# EAGLE board HA_FONA_LARA_20 (EAGLE 9.6.1)
REV: B
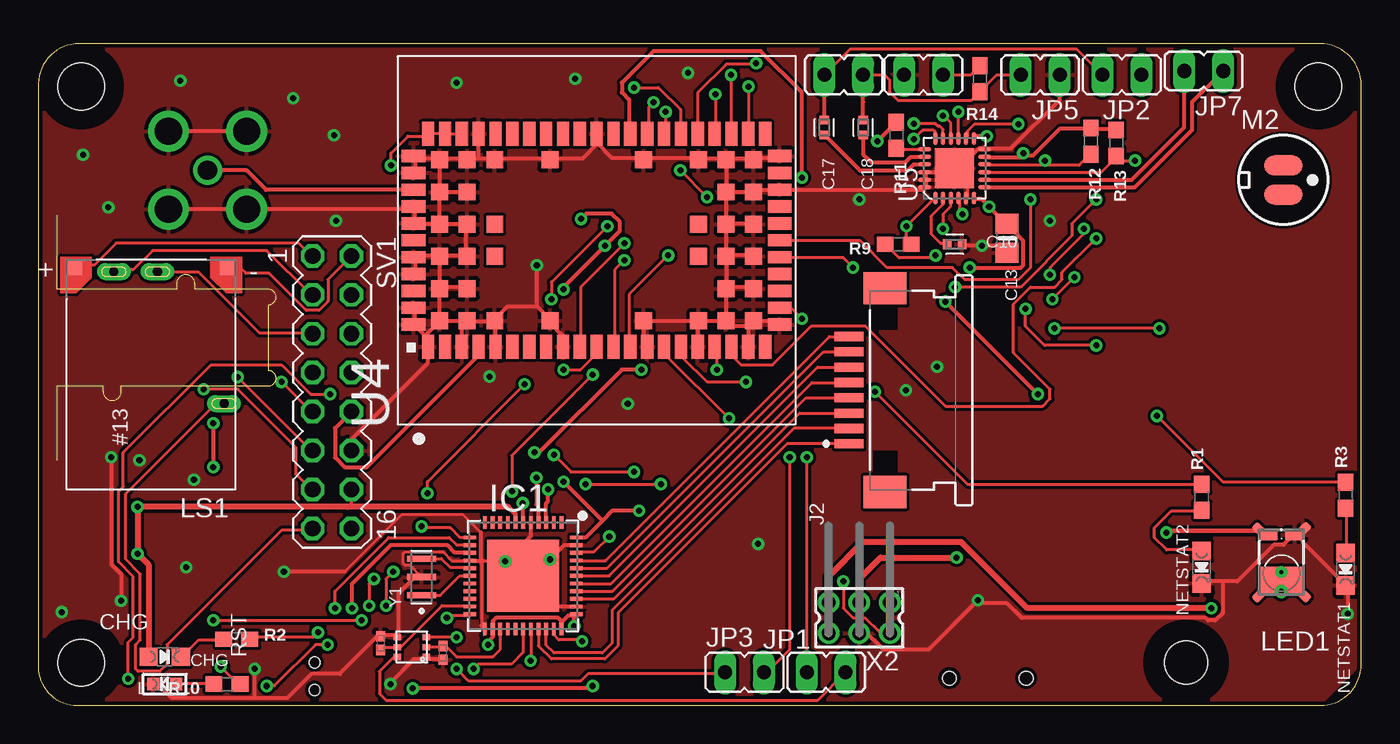
[diagram p2: board, top side]
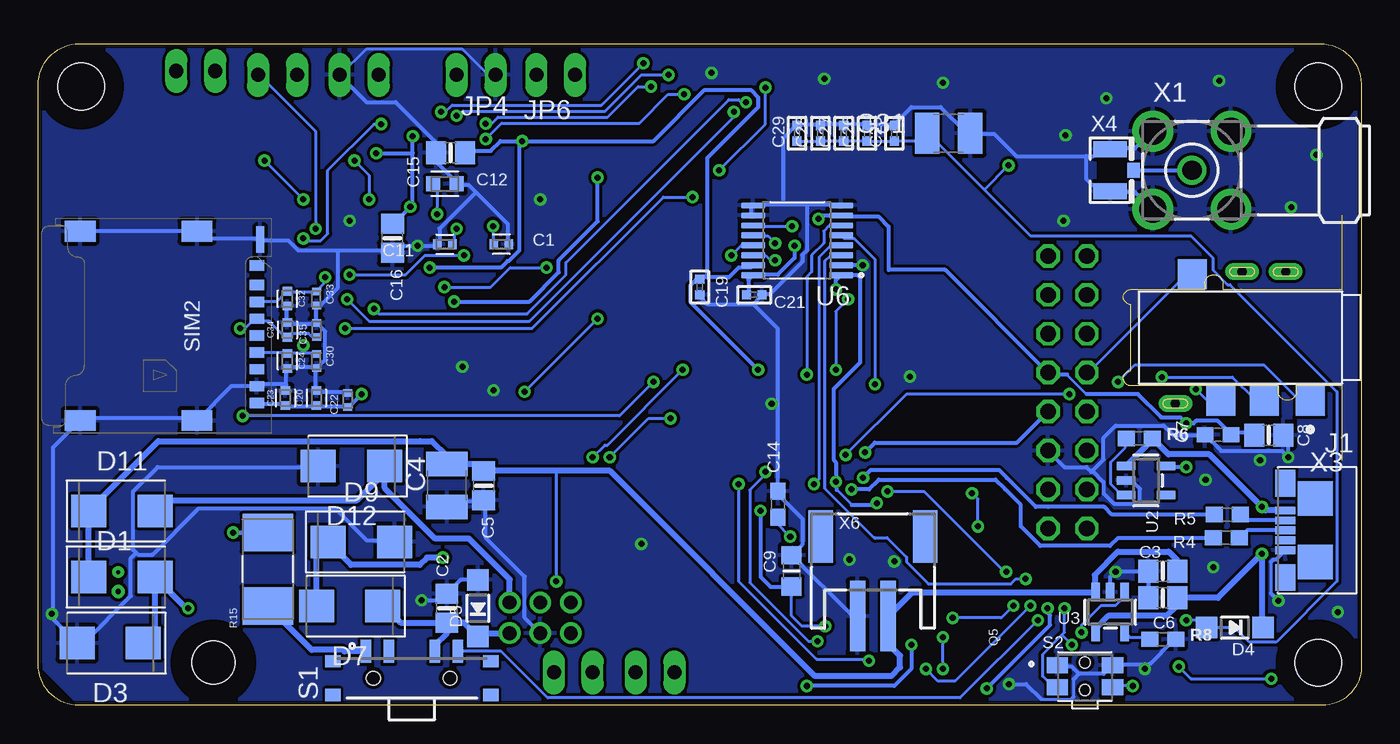
[diagram p3: board, bottom side, seen from below]

Size 86.36 x 43.18 mm. Coordinates in mm from the lower left corner, seen from the top.
Outline: 2.54,0 83.69,0 arc90 86.36,2.67 86.36,40.51 arc90 83.69,43.18 2.67,43.18 arc89 0,40.57 0,13.97 0,2.54 arc90 2.54,0
Copper layers (1*16): Top 0.035mm / dielectric 1.5mm / Bottom 0.035mm
Design rules "adafruit 6-6 *": minimum track width 6mil, minimum drill 15.5mil, track to track 8mil, track to pad 6mil, pad to pad 8mil, via to via 8mil, smd to smd 8mil, copper to edge 10mil, drill to drill 8mil, minimum pad ring 10mil, minimum via ring 8mil, stop-mask expansion 2mil, vias tented up to drill 20mil, thermal gap 10mil
Net classes: 0 default: width 0.19 mm, drill 0.19 mm
Holes 3.05 mm at 2.79,2.79 2.79,40.39 83.57,40.39
Holes 2.79 mm at 74.93,2.79
tKeepout: area 0,31 to 23.5,39.5
bKeepout: area 0,30.9 to 23.4,39.5
tRestrict: area 80.8,37.6 to 86.4,43.2; area 0,0 to 5.6,5.6; area 72.1,0 to 77.7,5.6; area 0,37.6 to 5.6,43.2
bRestrict: area 0,0 to 5.6,5.6; area 80.8,37.6 to 86.4,43.2; area 72.1,0 to 77.7,5.6; area 0,37.6 to 5.6,43.2
vRestrict: area 0,0 to 5.6,5.6; area 0,37.6 to 5.6,43.2; area 80.8,37.6 to 86.4,43.2; area 72.1,0 to 77.7,5.6

## Footprints (pad centres in the part's own frame; a part is rotated, then mirrored left to right if it is on the bottom)
CAPC1005X60 = smd 0.56 x 0.629: 1 -0.485,0; 2 0.485,0
0805-NO = smd 1.3 x 1.5: 1 -0.95,0; 2 0.95,0
C1210 = smd 1.6 x 2.7: 1 -1.4,0; 2 1.4,0
0603-NO = smd 1.1 x 1: 1 -0.85,0; 2 0.85,0
_0805MP = smd 1.2 x 1.3: 1 -1.016,0; 2 1.016,0
CAPC1608X85 = smd 0.921 x 0.97: 1 -0.775,0; 2 0.775,0
_0402 = smd 0.6 x 0.6: 1 -0.508,0; 2 0.508,0
RESC1005X35N = smd 0.49 x 0.6: 1 -0.457,0; 2 0.457,0
CHIPLED_0805_NOOUTLINE = smd 1.2 x 1.2: A 0,-1.05; C 0,1.05
DIOM5336X265N = smd 2.284 x 2.124: 1 -2.164,0; 2 2.164,0
SOD-123 = smd 1.4 x 1.4: A 1.85,0; C -1.85,0
TQFN44_7MM = smd 0.25 x 0.8: 1 -2.5,-3.475; 2 -2,-3.475; 3 -1.5,-3.475; 4 -1,-3.475; 5 -0.5,-3.475; 6 0,-3.475; 7 0.5,-3.475; 8 1,-3.475; 9 1.5,-3.475; 10 2,-3.475; 11 2.5,-3.475; 23 2.5,3.475; 24 2,3.475; 25 1.5,3.475; 26 1,3.475; 27 0.5,3.475; 28 0,3.475; 29 -0.5,3.475; 30 -1,3.475; 31 -1.5,3.475; 32 -2,3.475; 33 -2.5,3.475 | smd 0.8 x 0.25: 12 3.475,-2.5; 13 3.475,-2; 14 3.475,-1.5; 15 3.475,-1; 16 3.475,-0.5; 17 3.475,0; 18 3.475,0.5; 19 3.475,1; 20 3.475,1.5; 21 3.475,2; 22 3.475,2.5; 34 -3.475,2.5; 35 -3.475,2; 36 -3.475,1.5; 37 -3.475,1; 38 -3.475,0.5; 39 -3.475,0; 40 -3.475,-0.5; 41 -3.475,-1; 42 -3.475,-1.5; 43 -3.475,-2; 44 -3.475,-2.5 | smd 4.7 x 4.7: THERMAL 0,0
CUI_SJ2-35984E-SMT-TR = smd 1.9 x 1.95: 1 -4.55,4.125; 2 3.15,-4.125; 3 1.3,4.125; 4 -1.55,4.125 | drill 0.6 long: 10 4.25,4.3; 11 -0.1,-4.3; 12 -2.95,-4.3
MOLEX_52271-0879_0 = smd 0.6 x 1.9: 1 -3.5,1.175; 2 -2.5,1.175; 3 -1.5,1.175; 4 -0.5,1.175; 5 0.5,1.175; 6 1.5,1.175; 7 2.5,1.175; 8 3.5,1.175 | smd 2.1 x 2.8: MP1 -6.65,-1.175; MP2 6.65,-1.175
JP1 = drill 0.914 long: 1 0,-1.27; 2 0,1.27
MICROBUILDER_CHIPLED_0603 = smd 0.8 x 0.8: A 0,-0.75; C 0,0.75
LUXEON_REBEL = smd 1.26 x 0.73: A 0.87,-2.51; C -0.87,-2.51 | smd 1.1 x 0.57 rotated 315: A@1 1.39,-2.78 | smd 1.1 x 0.57 rotated 225: C@1 -1.39,-2.79 | smd 2.86 x 1.83: TH 0.01,0.49 | smd 1.1 x 0.57 rotated 135: TH@1 -1.39,1.37 | smd 1.1 x 0.57 rotated 45: TH@2 1.39,1.38 | drill 0.25 pad 0.35: TH@3 0.01,-0.06 | drill 0.35 pad 0.5: TH@4 0.01,1.2
SPKR_CMS-151135-078S-67 = smd 1 x 1: M -5,-6.99; P 5,-6.99
WM-61A = smd 2.5 x 1.3: 1 0,0.95; 2 0,-0.95
PWR_SC70-6L2 = smd 0.4 x 0.5: 1 -0.65,-0.95; 2 0,-0.95; 3 0.65,-0.95; 4 0.65,0.95; 5 0,0.95; 6 -0.65,0.95
0402-1005X55N = smd 0.62 x 0.62: 1 -0.45,0; 2 0.45,0
RESC6331X80N = smd 2.44 x 3.32: 1 -2.39,0; 2 2.39,0
SW_PCM13SMTR = smd 0.7 x 1.5: 1 -3,1.75; 2 -1.5,1.75; 3 1.5,1.75; 4 3,1.75 | smd 1 x 0.8: P$1 -5.15,1.1; P$2 -5.15,-1.1; P$3 5.15,1.1; P$4 5.15,-1.1 | hole 0.9: -2.5,0; 2.5,0
SW_EVQ-P7L01P = smd 1.4 x 1.05: 1_1 -1.8,0.725; 1_2 1.8,0.725; 2_1 -1.8,-0.725; 2_2 1.8,-0.725 | hole 0.7: 0,0.9; 0,-0.9
MICROSIM8 = smd 0.67 x 0.95: CLK -0.47,6.77; GND 3.93,6.77; IO -1.57,6.77; NC1 -2.67,6.77; NC2 -3.94,6.77; RST 1.73,6.77; SW 2.83,6.77; VCC 5.03,6.77; VPP 0.63,6.77 | smd 1.7 x 0.5: SH1 -5.64,6.995 | smd 1.35 x 2: SH2 -6.175,2.865; SH3 6.175,2.865; SH4 -6.175,-4.755; SH5 6.175,-4.755
MA08-2 = drill 1.016 octagon: 1 -8.89,-1.27; 2 -8.89,1.27; 3 -6.35,-1.27; 4 -6.35,1.27; 5 -3.81,-1.27; 6 -3.81,1.27; 7 -1.27,-1.27; 8 -1.27,1.27; 9 1.27,-1.27; 10 1.27,1.27; 11 3.81,-1.27; 12 3.81,1.27; 13 6.35,-1.27; 14 6.35,1.27; 15 8.89,-1.27; 16 8.89,1.27
SOT23-5 = smd 0.55 x 1.2: 1 -0.95,-1.3; 2 0,-1.3; 3 0.95,-1.3; 4 0.95,1.3; 5 -0.95,1.3
XCVR_LARA-R2 = smd 1.55 x 0.8: 1 -6.95,11; 2 -6.95,9.9; 3 -6.95,8.8; 4 -6.95,7.7; 5 -6.95,6.6; 6 -6.95,5.5; 7 -6.95,4.4; 8 -6.95,3.3; 9 -6.95,2.2; 10 -6.95,1.1; 11 -6.95,0; 12 -6.95,-1.1; 13 -6.95,-2.2; 14 -6.95,-3.3; 15 -6.95,-4.4; 16 -6.95,-5.5; 17 -6.95,-6.6; 18 -6.95,-7.7; 19 -6.95,-8.8; 20 -6.95,-9.9; 21 -6.95,-11; 33 6.95,-11; 34 6.95,-9.9; 35 6.95,-8.8; 36 6.95,-7.7; 37 6.95,-6.6; 38 6.95,-5.5; 39 6.95,-4.4; 40 6.95,-3.3; 41 6.95,-2.2; 42 6.95,-1.1; 43 6.95,0; 44 6.95,1.1; 45 6.95,2.2; 46 6.95,3.3; 47 6.95,4.4; 48 6.95,5.5; 49 6.95,6.6; 50 6.95,7.7; 51 6.95,8.8; 52 6.95,9.9; 53 6.95,11 | smd 0.8 x 1.55: 22 -5.5,-11.95; 23 -4.4,-11.95; 24 -3.3,-11.95; 25 -2.2,-11.95; 26 -1.1,-11.95; 27 0,-11.95; 28 1.1,-11.95; 29 2.2,-11.95; 30 3.3,-11.95; 31 4.4,-11.95; 32 5.5,-11.95; 54 5.5,11.95; 55 4.4,11.95; 56 3.3,11.95; 57 2.2,11.95; 58 1.1,11.95; 59 0,11.95; 60 -1.1,11.95; 61 -2.2,11.95; 62 -3.3,11.95; 63 -4.4,11.95; 64 -5.5,11.95 | smd 1.1 x 1.1: 65 -5.25,10.25; 66 -3.15,10.25; 67 -1.05,10.25; 68 1.05,10.25; 69 3.15,10.25; 70 5.25,10.25; 71 -5.25,8.45; 72 -3.15,8.45; 73 -1.05,8.45; 74 1.05,8.45; 75 3.15,8.45; 76 5.25,8.45; 77 -5.25,6.65; 78 5.25,6.65; 79 -5.25,3.05; 80 5.25,3.05; 81 -5.25,-3.05; 82 5.25,-3.05; 83 -5.25,-6.65; 84 5.25,-6.65; 85 -5.25,-8.45; 86 -3.15,-8.45; 87 -1.05,-8.45; 88 1.05,-8.45; 89 3.15,-8.45; 90 5.25,-8.45; 91 -5.25,-10.25; 92 -3.15,-10.25; 93 -1.05,-10.25; 94 1.05,-10.25; 95 3.15,-10.25; 96 5.25,-10.25; 97 -1.05,6.65; 98 1.05,6.65; 99 -1.05,-6.65; 100 1.05,-6.65
QFN50P400X400X75-25N = smd 0.85 x 0.3: 1 -1.95,1.25; 2 -1.95,0.75; 3 -1.95,0.25; 4 -1.95,-0.25; 5 -1.95,-0.75; 6 -1.95,-1.25; 13 1.95,-1.25; 14 1.95,-0.75; 15 1.95,-0.25; 16 1.95,0.25; 17 1.95,0.75; 18 1.95,1.25 | smd 0.3 x 0.85: 7 -1.25,-1.95; 8 -0.75,-1.95; 9 -0.25,-1.95; 10 0.25,-1.95; 11 0.75,-1.95; 12 1.25,-1.95; 19 1.25,1.95; 20 0.75,1.95; 21 0.25,1.95; 22 -0.25,1.95; 23 -0.75,1.95; 24 -1.25,1.95 | smd 2.6 x 2.6: 25 0,0
SOP65P640X120-16N = smd 1.57 x 0.41: 1 -2.87,2.275; 2 -2.87,1.625; 3 -2.87,0.975; 4 -2.87,0.325; 5 -2.87,-0.325; 6 -2.87,-0.975; 7 -2.87,-1.625; 8 -2.87,-2.275; 9 2.87,-2.275; 10 2.87,-1.625; 11 2.87,-0.975; 12 2.87,-0.325; 13 2.87,0.325; 14 2.87,0.975; 15 2.87,1.625; 16 2.87,2.275
BU-SMA-H = drill 1.27: 1 0,0 | drill 1.778: 2 -2.55,2.55; 3 2.55,2.55; 4 2.55,-2.55; 5 -2.55,-2.55
332-06 = drill 0.9 pad 1.27: 1 -2,-1; 2 -2,1; 3 0,-1; 4 0,1; 5 2,-1; 6 2,1
CONN_2173157-3 = smd 0.5 x 1.3: 1 -1.3,0; 2 -0.65,0; 3 0,0; 4 0.65,0; 5 1.3,0 | smd 1.75 x 1.3: S1 -3.075,0; S2 3.075,0 | smd 2.25 x 2.3: S3 -2.075,-1.95; S4 2.075,-1.95
U.FL = smd 2.2 x 1.05: 1 0,1.375; 2 0,-1.375 | smd 0.8 x 1: 3 1.525,0
JSTPH2 = smd 1 x 4.6: 1 -1,-3.7; 2 1,-3.7 | smd 1.6 x 3.4: NC1 -3.4,1.5; NC2 3.4,1.5
OSC_CSTNE8M00GH5C000R0 = smd 0.4 x 1.9: 1 -1.2,0; 2 0,0; 3 1.2,0

## Placement (x,y rotation side)
C1  1.0µF  [CAPC1005X60]  56.13,30.1 0 bottom
C2  33pF  [0805-NO]  59.69,6.35 90 bottom
C3  10µF  [0805-NO]  12.95,8.76 180 bottom
C4  100uF  [C1210]  59.69,14.35 270 bottom
C5  10pF  [0805-NO]  57.28,14.35 270 bottom
C6  10µF  [0805-NO]  12.96,7.03 180 bottom
C7  1uF  [0603-NO]  9.35,17.67 180 bottom
C8  10µF  [0805-NO]  6.04,17.64 0 bottom
C9  10uF  [_0805MP]  37.18,8.79 90 bottom
C10  1.0µF  [CAPC1005X60]  59.82,30.1 0 top
C11  1.0µF  [CAPC1005X60]  59.82,30.1 180 bottom
C12  2.2µF  [CAPC1608X85]  59.82,34.04 0 bottom
C13  100nF  [0805-NO]  63.25,30.48 270 top
C14  1uF  [0603-NO]  38.07,13.13 90 bottom
C15  10µF  [0805-NO]  59.44,36.07 180 bottom
C16  10µF  [0805-NO]  63.25,30.48 270 bottom
C17  1.0µF  [CAPC1005X60]  51.31,37.72 270 top
C18  1.0µF  [CAPC1005X60]  53.85,37.72 270 top
C19  100nF  [_0402]  43.18,27.3 270 bottom
C20  47 pF  [CAPC1005X60]  68.2,20.07 90 bottom
C21  100nF  [_0402]  39.62,26.8 0 bottom
C22  PESD0402-140  [RESC1005X35N]  66.17,19.94 90 bottom
C23  100 nF  [CAPC1005X60]  70.23,20.07 90 bottom
C24  47 pF  [CAPC1005X60]  70.1,22.48 270 bottom
C25  8.2pF  [_0402]  30.48,37.34 90 bottom
C26  15pF  [_0402]  32.26,37.34 90 bottom
C27  68pF  [_0402]  33.78,37.34 90 bottom
C28  10nF  [_0402]  35.31,37.34 90 bottom
C29  100nF  [_0402]  36.83,37.34 90 bottom
C30  PESD0402-140  [RESC1005X35N]  68.2,22.48 270 bottom
C31  330uF  [C1210]  26.92,37.34 0 bottom
C32  47 pF  [CAPC1005X60]  70.1,26.54 270 bottom
C33  PESD0402-140  [RESC1005X35N]  68.2,26.54 270 bottom
C34  47 pF  [CAPC1005X60]  70.1,24.51 90 bottom
C35  PESD0402-140  [RESC1005X35N]  68.2,24.51 90 bottom
CHG  ORANGE  [CHIPLED_0805_NOOUTLINE]  8.26,3.17 270 top
D1  DIODE  [DIOM5336X265N]  80.9,8.38 0 bottom
D3  DIODE  [DIOM5336X265N]  81.66,4.06 180 bottom
D4  MBR120  [SOD-123]  8.26,5.08 180 bottom
D5  MMSZ5231BT1G  [SOD-123]  57.66,6.35 90 bottom
D7  DIODE  [DIOM5336X265N]  66.04,6.48 180 bottom
D9  DIODE  [DIOM5336X265N]  65.28,10.67 0 bottom
D11  DIODE  [DIOM5336X265N]  80.9,12.7 0 bottom
D12  DIODE  [DIOM5336X265N]  65.91,15.62 180 bottom
IC1  ATMEGA32U4-MU  [TQFN44_7MM]  31.65,8.46 180 top
J1  SJ2-35984E-SMT-TR  [CUI_SJ2-35984E-SMT-TR]  7.87,24 180 bottom
J2  MOLEX_52271-0879MOLEX_52271-0879_0_0  [MOLEX_52271-0879_0]  54.1,20.57 90 top
JP1  [JP1]  51.44,2.16 90 top
JP2  [JP1]  70.74,41.15 270 top
JP3  [JP1]  46.1,2.16 270 top
JP4  [JP1]  57.78,41.15 270 top
JP5  [JP1]  65.41,41.15 90 top
JP6  [JP1]  52.58,41.15 90 top
JP7  [JP1]  76.07,41.4 90 top
L  RED  [MICROBUILDER_CHIPLED_0603]  8.26,1.4 90 top
LED1  LUXEON_REBEL  [LUXEON_REBEL]  81.15,8.64 180 top
LS1  CMS-151135-078S-67  [SPKR_CMS-151135-078S-67]  7.37,21.59 180 top
M2  ELECTRET_MICROPHON-WM-61A  [WM-61A]  81.28,34.29 0 top
NETSTAT1  BLUE  [CHIPLED_0805_NOOUTLINE]  85.34,8.89 180 top
NETSTAT2  GREEN  [CHIPLED_0805_NOOUTLINE]  75.95,9.02 180 top
Q5  2N7002DW-7-FNO_PAD  [PWR_SC70-6L2]  24.38,3.81 90 top
R1  1K  [0603-NO]  75.95,13.59 90 top
R2  1K  [0603-NO]  12.95,4.32 0 top
R3  1K  [0603-NO]  85.34,13.72 90 top
R4  22  [0603-NO]  8.8,10.94 180 bottom
R5  22  [0603-NO]  8.74,12.46 180 bottom
R6  100k  [0603-NO]  14.48,17.42 0 bottom
R7  1M2  [0402-1005X55N]  26.42,3.43 90 top
R8  2.2K  [0603-NO]  12.95,4.32 0 bottom
R9  2.2K  [0603-NO]  56.13,30.1 180 top
R10  2.2K  [0603-NO]  12.32,1.4 180 top
R11  10K  [0603-NO]  56.01,37.21 270 top
R12  4.7K  [0603-NO]  68.71,36.83 270 top
R13  4.7K  [0603-NO]  70.36,36.7 270 top
R14  1.2K  [0603-NO]  61.47,40.89 90 top
R15  CRM2512-JZ-R047ELF  [RESC6331X80N]  71.37,8.89 90 bottom
R16  1M2  [0402-1005X55N]  22.35,4.06 270 top
S1  PCM13SMTR  [SW_PCM13SMTR]  61.98,1.78 0 bottom
S2  EVQ-P7L01P  [SW_EVQ-P7L01P]  18.03,1.91 0 bottom
SIM2  -  [MICROSIM8]  78.87,24.77 270 bottom
SV1  [MA08-2]  19.18,20.45 270 top
U2  AP2112-3.3K  [SOT23-5]  14.05,14.68 270 bottom
U3  MCP73831T-2ACI/OT  [SOT23-5]  16.38,6.1 180 bottom
U4  LARA-R2  [XCVR_LARA-R2]  36.45,30.35 90 top
U5  MAX9860ETG+  [QFN50P400X400X75-25N]  59.82,35.05 90 top
U6  SN74AVC4T774PW  [SOP65P640X120-16N]  36.83,30.35 180 bottom
X1  BU-SMA-H  [BU-SMA-H]  11.05,34.92 0 bottom
X2  332-06  [332-06]  53.59,5.71 180 top
X3  2173157-3  [CONN_2173157-3]  4.95,11.43 90 bottom
X4  uFL  [U.FL]  16.38,34.92 0 bottom
X6  JSTPH  [JSTPH2]  31.88,9.53 0 bottom
Y1  CSTNE8M00GH5C000R0  [OSC_CSTNE8M00GH5C000R0]  25.02,8.38 90 top

## Tracks (layer width: path | path; a pad name or v marks a point on that pad's centre or on a via)
5_UART_CTS  (via drill 0.39)
  Top 0.19: v26.67,5.71 26.83,5.87 28.1,5.87 IC1.22 | v22.7,6.51 22.7,8.26 v23.18,8.73 | v30.92,13.97 30.92,16.32 v36.2,21.59
  Bottom 0.19: v26.67,5.71 23.5,5.71 v22.7,6.51 | v23.18,8.73 23.3,8.73 28.54,13.97 v30.92,13.97 | v36.2,21.59 36.2,27.97 35.88,28.29 35.88,29.37 35.08,30.16 35.08,30.96 34.77,31.27 33.97,31.27 U6.6
6_UART_RTS  (via drill 0.39)
  Top 0.19: IC1.12 27.54,10.96 26.91,11.59 25.11,11.59 v25.02,11.68 | v25.4,13.84 25.4,14.61 v31.75,20.95
  Bottom 0.19: U6.5 33.76,30.48 33.1,30.48 31.75,29.13 v31.75,20.95 | v25.02,11.68 25.02,13.46 v25.4,13.84
8_UART_TXD  (via drill 0.39)
  Top 0.19: v28.42,2.38 28.73,2.7 30.89,2.7 31.65,3.46 IC1.28 | v21.59,6.51 21.59,7.94 v21.91,8.26
  Bottom 0.19: U6.3 34.62,29.38 34.99,29 34.99,14.15 31.74,10.89 31.75,10.95 30.96,10.95 29.69,9.68 29.69,9.37 28.26,7.94 22.86,7.94 22.54,8.26 v21.91,8.26 | v28.42,2.38 27.62,1.59 26.51,1.59 v21.59,6.51
9_UART_RXD  (via drill 0.39)
  Top 0.19: v35.72,14.45 v40.64,14.45 | v32.13,2.92 32.15,2.94 IC1.29
  Bottom 0.19: U6.4 34.62,30.03 35.39,29.26 35.39,14.78 v35.72,14.45 | v40.64,14.45 40.64,8.1 35.56,3.02 32.23,3.02 v32.13,2.92
13  (via drill 0.39)
  Top 0.19: v35.5,4.19 35.4,4.29 33.97,4.29 33.66,4.6 33.66,4.92 IC1.32 | v38.89,15.24 34.77,15.24 v33.66,16.35 | v19.05,20.32 17.78,20.32 15.88,22.23 11.27,22.23 5.56,16.51 5.56,14.29 5.24,13.97 5.24,9.37 6.19,8.41 6.19,4.45 5.87,4.13 v5.87,1.75 | v11.91,2.54 13.02,1.43 R10.1
  Bottom 0.19: v38.89,15.24 38.89,15.08 39.91,14.07 39.91,8.01 36.09,4.19 v35.5,4.19 | v33.66,16.35 29.69,20.32 v19.05,20.32 | v5.87,1.75 11.11,1.75 v11.91,2.54
+3V3  (via drill 0.39)
  Top 0.254: 36.83,12.06 37.47,12.7 v39.21,12.7 | 36.83,12.06 35.72,10.95 35.24,10.95 IC1.44 | 34.2,5.46 33.94,5.71 29.88,5.71 29.69,5.52 29.69,5.08 IC1.24 29.69,4.92 29.69,4.48 29.37,4.16 v29.37,3.97 | IC1.33 34.13,5.08 34.13,5.4 34.2,5.46 | v20.48,6.35 20.48,7.94 23.02,10.48 26.67,10.48 27.15,10 28.1,10 IC1.14 | v24.45,1.11 36.04,1.11 v36.2,1.27 | 34.2,5.46 34.61,5.87 35.08,5.87 IC1.34 35.18,5.91 34.99,5.91 v34.99,5.17 | v34.29,27.15 34.29,27.3 v36.99,30 37.97,30.98 37.97,31.56 37.44,32.1 35.78,32.1 v35.43,31.75 | v11.43,18.41 v11.43,15.56 | v34.29,14.61 36.83,12.06 | IC1.6 31.65,13.2 31.64,13.19 v31.62,13.21
  Bottom 0.19: 17.94,20.32 19.21,21.59 | 33.24,13.08 34.23,14.06 | 37.21,7.74 C9.1 37.2,7.75 37.2,5.85 36.52,5.17 v34.99,5.17
  Bottom 0.254: v20.48,6.35 20.48,6.03 20.32,5.87 20.32,5.24 v24.45,1.11 | v36.2,1.27 30.48,1.27 29.37,2.38 v29.37,3.97 | C21.1 40.01,26.83 40.01,27.78 39.85,27.94 U6.16 39.69,28.1 38.1,28.1 36.99,29.21 v36.99,30 | C8.1 7.14,17.78 8.41,17.78 C7.1 8.57,17.78 9.37,18.57 10.79,18.57 10.95,18.41 v11.43,18.41 11.81,18.8 13.05,18.8 14.57,20.32 17.94,20.32 | v11.43,15.56 12.7,15.56 U2.5 | 19.21,21.59 20.32,21.59 SV1.8 27.15,28.42 30.86,28.42 30.86,31.24 31.53,31.91 33.81,31.91 U6.7 35.2,31.98 v35.43,31.75 | 34.23,14.06 34.23,14.54 v34.29,14.61 34.29,15.88 34.45,16.03 34.45,20.64 32.7,22.38 32.7,27.94 32.8,28.04 32.83,28.04 32.88,28.08 U6.1 34.29,27.75 v34.29,27.15 | v31.62,13.21 31.75,13.08 33.24,13.08 | v39.21,12.7 39.21,8.39 38.56,7.74 37.21,7.74 | 37.18,7.37 C9.1
A0
  Top 0.19: J2.1 48.87,17.07 37.86,6.06 37.86,3.9 36.99,3.04 33.49,3.04 32.65,3.87 IC1.30
A1
  Top 0.19: J2.2 49.32,18.07 37.47,6.22 37.47,4.06 36.83,3.43 33.66,3.43 33.15,3.93 IC1.31
A2
  Top 0.19: IC1.36 37.57,6.96 49.69,19.07 J2.3
A3
  Top 0.19: IC1.37 37.5,7.46 50.12,20.07 J2.4
A4
  Top 0.19: IC1.38 37.38,7.96 50.5,21.07 J2.5
A5
  Top 0.19: IC1.39 37.26,8.46 50.88,22.07 J2.6
A6
  Top 0.19: IC1.40 37.14,8.96 51.26,23.07 J2.7
A7
  Top 0.19: IC1.41 37.02,9.46 51.64,24.07 J2.8
AREF  (via drill 0.39)
  Top 0.19: v37.27,11.02 36.26,10 35.24,10 IC1.42
  Bottom 0.19: v37.27,11.02 38.22,11.96 C14.1
CODEC_BIAS  (via drill 0.39)
  Top 0.19: R9.1 56.83,30.16 56.67,30.32 v56.67,31.27 58.42,33.02 U5.1
  Bottom 0.19: v56.67,31.27 56.67,30.16 C1.1
D+  (via drill 0.39)
  Top 0.19: IC1.4 32.7,11.91 32.64,11.99
  Top 0.254: 32.64,11.99 32.64,12.98 32.51,13.11 v32.51,14.86
  Bottom 0.254: R5.2 16.27,12.46 16.77,12.96 20.45,12.96 21.25,12.96 23.14,14.86 23.65,15.37 32,15.37 v32.51,14.86
D-  (via drill 0.39)
  Top 0.254: IC1.3 33.15,13.17 33.15,13.2 33.27,13.32 v33.27,14.1
  Bottom 0.254: R4.2 15.86,10.94 16.4,10.41 20.95,10.41 22.23,11.68 22.23,13.08 23.24,14.1 23.88,14.73 31.5,14.73 32.13,14.1 v33.27,14.1
EN
  Bottom 0.19: R6.1 15.4,17.3 15.4,16.83 16.35,15.88 16.35,14.45 15.72,13.81 15.4,13.81 U2.3
GND  (via drill 0.39)
  Top 0.19: IC1.15 28.32,9.46 26.99,9.46 26.42,10.03 23.97,10.03 23.82,9.88 23.82,9.28 23.97,9.13 24.27,9.13 Y1.2 | 29.06,9.4 29,9.46 | v30.48,9.4 29.06,9.4 | 28.92,9.28 28.92,5.2 | 28.93,9.27 29.06,9.4 | 20,8.73 23.72,12.45 27.72,12.45 28.89,11.27 | 60.64,34.13 60.64,33.18 U5.5 | 46.35,24.77 U4.91 | 27.94,25.08 27.62,25.08 | 35.11,10.48 IC1.43
  Top 0.254: IC1.5 32.15,11.07 v30.48,9.4 30.61,9.53 v33.4,9.53 | v85.47,5.97 85.47,7.71 NETSTAT1.C 85.25,7.94 82.55,10.64 82.55,11.27 LED1.C@1 82.39,11.27 82.07,11.27 LED1.C 81.92,11.11 81.28,10.48 80.64,10.48 78.26,8.1 77.31,8.1 | X2.4 54.09,4.71 55.16,3.65 58.14,3.65 v61.34,6.86 61.44,6.67 63.25,6.67 64.2,5.71 76.2,5.71 76.36,5.56 76.83,5.56 77.31,6.03 77.31,8.1 | 28.32,9.46 28.89,9.46 | 28.89,9.46 29,9.46 | R7.1 26.35,3.02 25.4,3.02 Q5.1 25.24,3.02 24.51,3.02 22.99,1.49 v22.99,1.4 | 14.13,0.48 16.26,0.48 17.84,2.06 19.68,2.06 22.23,4.6 R16.1 22.38,4.6 23.34,4.6 Q5.4 23.5,4.6 23.5,7.3 24.77,8.57 Y1.2 | 14.13,0.48 8.73,0.48 7.94,1.27 7.62,1.27 L.C | 14.13,0.48 v14.13,2.38 | IC1.23 28.92,5.2 | 28.93,9.27 28.92,9.28 | 20,8.73 v16.03,8.73 | 28.89,9.46 28.89,11.27 | X1.4 8.57,32.38 13.49,32.38 X1.5 13.65,32.38 24.61,32.38 | X1.3 8.57,37.47 13.49,37.47 X1.2 | 77.31,8.1 76.04,8.1 NETSTAT2.C | C10.2 60.33,30 v61.59,30 62.87,30 63.18,29.69 C16.2 | 57.94,34.77 57.94,34.45 U5.23 57.94,34.29 57.94,33.81 U5.24 57.78,33.66 48.42,33.66 U4.30 48.26,33.66 46.83,33.66 U4.95 46.67,33.5 44.93,33.5 | 59.91,34.86 59.85,34.92 U5.25 59.53,34.77 57.94,34.77 | 59.91,34.86 60.64,34.13 | 59.91,34.86 61.4,36.35 61.72,36.35 U5.12 61.91,36.35 63.5,36.35 66.67,39.53 JP5.1 | 57.94,34.77 U5.22 | U4.32 48.26,35.72 46.83,35.72 U4.96 46.67,35.72 44.93,35.72 U4.90 | U4.90 44.77,35.72 43.18,35.72 U4.84 43.02,35.72 39.53,35.72 U4.82 39.37,35.72 37.47,35.72 36.51,36.67 | 36.51,36.67 36.51,37.15 U4.43 36.51,36.67 | U4.90 44.93,35.56 44.93,33.66 U4.89 44.93,33.5 | 44.93,31.43 46.67,31.43 U4.94 | 44.93,27.3 46.67,27.3 U4.92
  Top 0.254: 44.93,29.37 46.67,29.37 U4.93 | 44.93,27.3 44.93,29.21 U4.87 44.93,29.37 | 44.93,27.3 U4.86 44.93,27.15 44.93,25.24 U4.85 | 44.93,29.37 44.93,31.27 U4.88 44.93,31.43 | U4.22 48.26,24.92 48.1,25.08 46.83,25.08 U4.91 46.67,25.08 46.35,24.77 | 46.35,24.77 46.35,23.5 U4.20 | 39.53,25.08 39.53,23.65 39.69,23.5 U4.14 | U4.85 44.77,25.08 43.18,25.08 U4.83 43.02,25.08 | 43.02,25.08 43.02,23.5 U4.17 | 43.02,25.08 39.53,25.08 | 39.53,25.08 U4.81 | 46.35,24.77 45.24,24.77 44.93,25.08 U4.85 | 44.93,31.43 44.93,33.5 | v5.4,6.83 5.4,8.57 4.76,9.21 v4.76,16.19 | U4.69 26.35,33.5 27.94,33.5 U4.75 | 24.61,35.72 26.19,35.72 U4.70 | U4.70 26.35,35.72 27.94,35.72 U4.76 28.1,35.72 28.73,35.72 | 28.73,35.72 29.69,35.72 U4.78 29.84,35.72 33.34,35.72 U4.80 33.5,35.72 35.56,35.72 36.51,36.67 | 24.61,35.72 24.61,34.77 U4.55 | 24.61,35.72 U4.54 | 28.73,35.72 28.73,37.15 U4.50 | U4.69 26.19,33.66 26.19,35.56 U4.70 | 26.19,31.43 24.61,31.43 U4.58 24.61,31.59 24.61,32.38 | 24.61,32.38 24.61,32.54 U4.57 24.61,32.38 | U4.66 26.35,27.3 27.94,27.3 U4.72 | U4.67 26.19,29.37 24.61,29.37 U4.60 24.61,29.21 24.61,28.26 U4.61 | 27.94,29.37 26.35,29.37 U4.67 | U4.66 26.19,27.3 26.19,29.21 U4.67 | 27.94,29.37 27.94,31.27 U4.74 27.94,31.43 26.35,31.43 U4.68 26.19,31.43 | 27.94,29.37 U4.73 | U4.9 34.13,23.5 34.13,24.23 33.5,24.86 33.5,25.08 U4.79 33.34,25.24 32.54,26.04 | 32.54,26.04 v32.54,28.73 | 25.24,24.13 24.61,24.77 U4.64 24.61,24.92 24.61,25.88 U4.63 | 25.24,24.13 25.4,23.97 25.4,23.5 U4.1 | U4.77 29.84,25.08 29.84,23.5 U4.5 | 27.62,25.08 26.35,25.08 U4.65 | 27.94,25.08 U4.71 | 27.62,25.08 27.62,23.5 U4.3 | 27.62,25.08 U4.71
  Top 0.254: U4.77 29.69,25.08 28.1,25.08 U4.71 | 25.24,24.13 26.19,25.08 U4.65 | 25.24,24.13 U4.1 | 32.54,26.04 30.64,26.04 29.84,25.24 U4.77 | U4.66 26.19,27.15 26.19,25.24 U4.65 | SV1.12 20.48,16.67 20.48,17.4 25.4,22.32 25.4,23.34 U4.1 | 26.19,31.43 U4.69 | IC1.35 33.93,6.46 33.4,6.99 v33.4,9.53 | v33.4,9.53 34.35,10.48 35.11,10.48
  Bottom 0.19: 5.87,7.3 5.87,9.37 | 56.99,41.15 58.66,42.82 64.97,42.82 66.67,41.12 | 20.89,0.41 18.91,0.41 | 18.76,0.55 18.76,1.72
  Bottom 0.254: v61.34,6.86 60.13,6.86 C2.2 58.79,8.2 D5.A | U3.2 16.38,8.13 16.38,8.38 v16.03,8.73 16,8.76 C3.2 C6.2 | 14.13,2.7 16.19,2.7 S2.1_2 16.35,2.54 16.83,2.06 18.41,2.06 | 14.13,2.7 13.81,2.7 12.22,4.29 R8.2 | 18.41,2.06 18.89,2.54 19.68,2.54 S2.1_1 | v14.13,2.38 14.13,2.7 | C9.2 36.48,10.5 36.48,12.19 37.94,13.65 37.94,13.97 C14.2 38.1,14.13 38.1,24.61 39.69,26.19 | X1.5 13.65,32.38 14.76,33.5 16.35,33.5 X4.2 16.51,33.66 17.24,33.66 17.97,34.38 17.97,35.85 | X1.2 13.65,37.47 14.76,36.35 16.35,36.35 X4.1 16.51,36.2 17.11,36.2 17.46,35.85 17.97,35.85 | 30.48,37.94 32.23,37.94 C26.2 32.38,37.94 33.66,37.94 C27.2 33.81,37.94 35.24,37.94 C28.2 35.4,37.94 36.83,37.94 C29.2 36.89,37.85 37.72,37.02 37.72,32.7 | 30.48,37.94 29.37,39.05 27.46,39.05 25.88,37.47 25.56,37.47 C31.2 25.4,37.31 23.97,37.31 22.51,35.85 17.97,35.85 | 30.48,37.94 C25.2 | 39.69,26.19 39.21,26.67 C21.2 39.05,26.83 38.61,26.83 36.48,28.96 36.48,29.4 36.2,29.69 36.2,32.7 | 39.69,26.19 42.7,26.19 43.18,26.67 C19.2 | 37.72,32.7 39.69,32.7 U6.9 39.85,32.54 39.85,32.07 U6.10 | 37.72,32.7 36.2,32.7 | 36.2,32.7 33.97,32.7 U6.8 | C4.2 59.42,13.34 57.31,13.34 C5.2 57.15,13.34 57.15,10.95 54.61,8.41 54.61,5.71 53.66,4.76 X2.4 | 79.98,9.97 80.33,9.62 80.33,7.14 83.34,4.13 83.82,4.13 D3.2 85.47,5.71 v85.47,5.97 85.41,6.03 85.41,16.83 83.66,18.57 SIM2.SH5 83.5,18.73 76.04,18.73 SIM2.SH3 73.76,20.84 SIM2.GND 72.07,20.95 70.17,20.95 | D9.2 63.18,10.79 64.93,10.79 66.99,12.86 75.88,12.86 78.9,9.84 79.85,9.84 79.98,9.97 | 79.98,9.97 80.17,10.16 80.17,13.97 78.58,15.56 68.1,15.56 D12.2 | 70.17,20.95 70.17,20.64 C23.2
  Bottom 0.254: 70.17,20.95 70.17,21.91 C24.2 70.01,22.07 68.26,22.07 C30.2 | C35.2 68.26,25.08 68.26,26.04 C33.2 67.96,26.09 66.83,27.21 66.83,29.69 | C32.2 70.17,26.04 70.17,25.08 C34.2 70.01,24.92 68.26,24.92 C35.2 | C22.2 66.2,20.48 68.1,20.48 C20.2 68.26,20.64 68.26,21.91 C30.2 | SIM2.SH4 83.5,30.96 76.04,30.96 SIM2.SH2 75.88,30.8 75.56,30.48 71.91,30.48 SIM2.SH1 71.75,30.32 70.01,30.32 69.37,29.69 66.83,29.69 | 57.78,33.5 58.26,33.97 58.9,33.97 C12.2 59.05,34.13 60.33,35.4 60.33,36.04 C15.2 60.48,36.2 60.48,36.83 63.02,39.37 64.93,39.37 66.67,41.12 JP5.1 | 57.78,33.5 55.72,31.43 55.72,30.16 C1.2 | 57.78,33.5 60.17,31.11 60.17,30.16 C10.2 60.33,30 v61.59,30 62.87,30 63.18,29.69 C16.2 63.34,29.69 66.83,29.69 | 5.87,9.37 5.71,9.53 5.56,9.53 5.08,10 X3.1 | v5.4,6.83 5.87,7.3 | 17.56,15.3 16.83,14.57 16.83,13.84 16.16,13.18 14.61,13.18 14.45,13.34 14.45,14.13 14.92,14.61 15.24,14.61 U2.2 | SV1.12 19.37,15.56 17.94,15.56 17.62,15.24 17.56,15.3 | v32.54,28.73 33.81,28.73 U6.2 | 17.56,15.3 16.83,16.03 16.83,17.46 16.03,18.26 12.89,18.26 12.26,17.62 10.32,17.62 C7.2 9.14,16.61 5.18,16.61 v4.76,16.19 4.76,17.31 C8.2 | JP4.1 56.99,41.15 | 18.91,0.41 18.76,0.55 | 18.76,1.72 18.41,2.06 | v22.99,1.4 21.88,1.4 20.89,0.41 | C30.2 68.17,22.02 67.62,22.57 67.62,24.41 68.17,24.97 C35.2 | X6.1 32.93,5.87 33.25,5.87 C9.2 | C9.2 36.42,9.05
  Bottom 0.406: v16.03,8.73 16,8.76
  other vias: 19.43,31.62 19.3,37.21 16.64,39.62 9.27,40.77 1.52,6.1 29.46,21.46 38.48,19.68 46.99,10.54 56.64,20.57 58.67,22.1 53.59,33.02 35.05,40.89 27.3,40.64 66.04,31.62 42.42,41.27 9.65,9.02 10.16,14.73 6.6,16 4.57,32.51 2.92,35.94
  pour Top: 1.65,43.05 83.82,43.05 84.2,42.67 86.23,40.64 86.23,39.37 86.23,2.67 85.72,2.16 83.57,0 82.68,0 4.19,0 3.81,0.38 0.13,4.06 0.13,5.59 0.13,40.26 0.13,41.53
  pour Bottom: 1.91,42.93 84.33,42.93 86.23,41.02 86.23,40.64 86.49,40.39 86.49,2.92 83.69,0.13 83.69,0 4.06,0 0.25,3.81 -0.13,3.81 -0.13,40.77 0.38,41.27
GPIO6_CODEC_CLK  (via drill 0.39)
  Top 0.19: v63.98,37.94 61.12,37.94 60.64,37.47 60.64,37.15 U5.14 | v69.06,30.48 66.83,28.26 66.83,27.78 66.36,27.3 64.77,27.3 63.66,26.19 63.66,23.02 66.04,20.64 66.04,20 65.56,19.53 59.21,19.53 53.98,24.77 50.48,24.77 47.94,22.23 45.88,22.23 45.4,22.7 45.4,23.34 U4.19
  Bottom 0.19: v63.98,37.94 64.45,37.94 67.47,34.92 67.47,30.8 67.94,30.32 68.9,30.32 v69.06,30.48
GSM_ANT
  Top 0.254: U4.56 14.87,33.65 13.6,34.92 X1.1
  Bottom 0.254: X4.3 X1.1
I2S_CLK  (via drill 0.39)
  Top 0.19: U5.18 58.55,37.02 58.55,37.45 58.46,37.53 57.72,37.53 v57.15,36.96 | v44.2,39.88 44.2,37.35 U4.36
  Bottom 0.19: v57.15,36.96 56.11,38 47.12,38 45.24,39.88 v44.2,39.88
I2S_RXD  (via drill 0.39)
  Top 0.19: U5.15 v60.07,38.73 | v46.86,41.91 46.8,41.85 44.92,41.85 43.08,40.01 43.05,40.01 43.05,40 U4.37
  Bottom 0.19: v60.07,38.73 59.79,38.73 59.34,39.18 49.59,39.18 v46.86,41.91
I2S_TXD  (via drill 0.39)
  Top 0.19: v59.05,38.48 59.1,38.48 59.57,38.02 U5.16 | v45.21,41.15 45.21,37.34 U4.35
  Bottom 0.19: v59.05,38.48 58.93,38.48 58.62,38.79 49.35,38.79 46.99,41.15 v45.21,41.15
I2S_WA  (via drill 0.39)
  Top 0.19: U5.17 59.05,37.01 59.05,37.59 58.86,37.78 58.77,37.78 58.58,37.97 v57.15,37.97 | v46.35,40.39 U4.34
  Bottom 0.19: v57.15,37.97 56.77,37.97 56.35,38.39 49.19,38.39 47.2,40.39 v46.35,40.39
M_PWR_ON  (via drill 0.39)
  Top 0.19: v45.09,18.73 40.96,22.86 40.96,23.34 U4.15 | v49.05,16.19 49.05,3.65 47.56,2.16 JP3.2
  Bottom 0.19: v45.09,18.73 46.51,18.73 v49.05,16.19
M_PWR_ON_PRE  (via drill 0.39)
  Top 0.19: v27.3,4.45 25.4,4.45 Q5.3 | v27.3,2.38 28.1,1.59 35.4,1.59 35.88,2.06 44.74,2.06 JP3.1
  Bottom 0.19: v27.3,2.38 v27.3,4.45
M_RESET_N  (via drill 0.39)
  Top 0.19: v44.29,21.91 44.29,23.34 U4.18 | JP1.2 v50.16,16.19
  Bottom 0.19: v44.29,21.91 49.21,16.99 49.37,16.99 v50.16,16.19
M_RESET_N_PRE
  Top 0.19: Q5.6 23.21,3.16 22.28,2.23 22.28,0.77 22.7,0.35 50.9,0.35 JP1.1
MIC_N
  Top 0.19: JP6.1 55.24,41.15 55.56,40.84 55.56,40.04 56.12,39.48 60.9,39.48 R14.1 62.57,41.15 JP5.2
  Top 0.254: C18.1 53.85,39.37 JP6.1
MIC_P
  Top 0.19: JP2.1 67.79,42.83 52.99,42.83 JP6.2
  Top 0.254: C17.1 JP6.2
MODEM_PWR_ON
  Top 0.19: R16.2 22.38,3.65 22.54,3.81 Q5.5 23.65,3.81 26.35,6.51 28.1,6.51 IC1.21
MODEM_RESET_N
  Top 0.19: Q5.2 26.35,3.81 R7.2 26.51,3.97 27.3,3.17 29.69,3.17 30.16,3.65 30.16,4.92 IC1.25
N$1
  Top 0.19: R2.1 12.06,4.29 10.48,4.29 9.37,3.17 CHG.C
N$2
  Top 0.19: L.A 9.05,1.43 11.43,1.43 R10.2
N$3  (via drill 0.39)
  Top 0.19: v18.26,4.76 17.94,4.45 13.81,4.45 R2.2
  Bottom 0.19: v18.26,4.76 18.26,5.24 16.99,6.51 16.03,6.51 15.56,6.99 15.56,7.3 U3.1
N$4
  Bottom 0.19: R8.1 13.81,4.45 15.08,4.45 15.4,4.76 U3.5
N$5
  Top 0.19: R1.1 75.88,12.7 73.98,12.7 72.87,11.59 72.87,10.95 73.66,10.16 75.88,10.16 NETSTAT2.A
N$6
  Bottom 0.305: 63.75,15.19 D12.1
  Bottom 0.406: D11.2 78.04,13.4 65.54,13.4 63.75,15.19 | X2.1 55.59,8.22 58.25,10.88 60.45,10.88 63.75,14.18 D12.1
N$8
  Top 0.254: U5.21 57.16,35.3 56.77,34.92 53.63,34.92 C17.2
N$9
  Top 0.19: R3.1 85.41,12.86 85.41,10 NETSTAT1.A
N$10  (via drill 0.39)
  Top 0.19: v60.33,32.07 60.17,32.23 60.17,33.02 U5.4
  Bottom 0.19: v60.33,32.07 60.33,33.81 60.48,33.97 C12.1
N$11
  Top 0.19: Y1.3 26.31,9.58 26.89,9.01 28.13,9.01 IC1.16
N$12
  Top 0.19: Y1.1 26.23,7.18 27.51,8.46 IC1.17
N$13  (via drill 0.39)
  Top 0.19: v59.05,31.11 59.05,32.07 59.53,32.54 59.53,33.02 U5.3
  Bottom 0.19: v59.05,31.11 59.21,30.96 59.21,30.16 C11.1
N$14
  Top 0.19: C10.1 59.21,30.16 58.9,30.16 58.26,30.8 58.26,31.91 59.05,32.7 59.05,33.02 U5.2
N$15
  Bottom 0.254: X3.4 7.51,12.08 R5.1
N$16
  Bottom 0.19: 7.46,11.43 R4.1
  Bottom 0.254: X3.3 7.46,11.43
N$17
  Top 0.254: C18.2 53.85,35.98 54.39,35.44 56.61,35.44 56.98,35.8 U5.20
N$18
  Top 0.19: U5.19 57.48,36.3 57.44,36.26 56.11,36.26 R11.2
N$20  (via drill 0.39)
  Top 0.19: v58.58,29.37 58.42,29.21 56.2,29.21 55.4,30 R9.2 | v66.04,28.1 66.04,28.57 68.26,30.8 v68.26,31.11
  Bottom 0.19: v58.58,29.37 61.12,29.37 62.39,28.1 v66.04,28.1 | v68.26,31.11 68.26,37.47 71.91,41.12 JP2.2
N$21
  Top 0.19: JP4.2 60.87,41.15 R14.2
N$22  (via drill 0.39)
  Top 0.406: X2.3 53.59,8.26 54.99,9.65 v59.94,9.65
  Bottom 0.406: D7.2 68.2,9.91 D9.1 65.95,9.17 61.47,9.17 60.99,9.65 v59.94,9.65
N$23  (via drill 0.39)
  Top 0.305: 53.85,10.66 53.85,10.67
  Top 0.406: 53.85,10.66 60.26,10.66 64.57,6.35 v76.58,6.35 | 53.85,10.67 51.59,8.41 X2.5
  Bottom 0.406: D3.1 78.73,4.83 D1.2 76.7,6.35 v76.58,6.35
N$24
  Top 0.19: J1.11 7.78,28.26 10.48,28.26 14.45,24.29 17.78,24.29 SV1.5
N$25  (via drill 0.39)
  Top 0.305: v73.64,11.28 73.77,11.42 LED1.A@1 LED1.A
  Bottom 0.305: R15.2 v73.64,11.28
N$26
  Top 0.19: J1.12 5.08,28.42 6.19,28.42 7.46,29.69 14.92,29.69 17.78,26.83 SV1.3
N$27
  Bottom 0.19: J1.2 11.11,28.1 11.43,28.1 17.78,21.75 SV1.7
N$28  (via drill 0.39)
  Top 0.19: v15.88,21.11 17.78,19.21 SV1.9
  Bottom 0.19: v15.88,21.11 14.76,22.23 6.35,22.23 4.13,20 3.33,20 J1.1
N$29  (via drill 0.39)
  Top 0.19: v13.02,21.43 17.78,16.67 SV1.11
  Bottom 0.19: v13.02,21.43 8.41,21.43 6.99,20 6.35,20 J1.4
N$30  (via drill 0.39)
  Top 0.19: v10.79,20.64 13.02,20.64 16.83,16.83 16.83,15.08 17.78,14.13 SV1.13
  Bottom 0.19: v10.79,20.64 10.16,20 9.21,20 J1.3
N$31
  Top 0.19: J1.10 12.06,19.68 11.59,19.68 5.71,13.81 5.71,9.53 6.67,8.57 6.67,4.29 6.35,3.97 6.35,2.38 6.51,2.22 7.94,2.22 8.41,2.7 8.41,3.97 15.88,11.43 17.78,11.43 SV1.15
NETSTAT1  (via drill 0.39)
  Top 0.19: v73.03,18.89 77.31,14.61 85.25,14.61 R3.2 | v46.2,21.11 43.66,21.11 42.07,22.7 42.07,23.34 U4.16
  Bottom 0.19: v73.03,18.89 48.42,18.89 v46.2,21.11
NETSTAT2  (via drill 0.39)
  Top 0.19: v54.61,20.48 60.64,14.45 75.88,14.45 R1.2 | v49.85,25.24 49.21,25.88 48.42,25.88 U4.23
  Bottom 0.19: v49.85,25.24 v54.61,20.48
ONBRD_SPKN
  Top 0.19: SV1.2 18.92,27.81 18.92,26.38 18.32,25.79 17.49,25.79 15.08,28.19 13.56,28.19 13.26,28.5 13.18,28.58 LS1.M
ONBRD_SPKP
  Top 0.19: LS1.P 2.38,28.73 2.44,28.73 3.65,28.73 5.08,30.16 16.99,30.16 17.68,29.47 17.78,29.37 SV1.1
RST  (via drill 0.39)
  Top 0.19: v19.37,6.35 19.37,7.46 22.86,10.95 26.83,10.95 27.3,10.48 28.1,10.48 IC1.13 | v14.92,1.27 15.4,1.27 18.1,3.97 v18.89,3.97
  Bottom 0.19: v19.37,6.35 19.37,4.76 19.53,4.6 | 19.53,4.6 20.8,3.33 20.8,1.91 20.16,1.27 19.84,1.27 S2.2_1 | v14.92,1.27 16.19,1.27 S2.2_2 | 19.53,4.6 v18.89,3.97
SCL  (via drill 0.39)
  Top 0.19: 65.72,35.24 67.94,35.24 68.58,35.88 R12.2 | 65.72,35.24 61.91,35.24 U5.10 | v64.77,33.02 64.77,28.57 63.98,27.78 60.48,27.78 59.69,28.57 55.4,28.57 53.66,30.32 48.42,30.32 U4.27 | 65.72,35.24 v65.72,35.56
  Bottom 0.19: v64.77,33.02 64.77,34.61 v65.72,35.56
SDA  (via drill 0.39)
  Top 0.19: U5.9 61.91,34.77 69.37,34.77 70.33,35.72 R13.2 70.48,35.72 70.64,35.56 v71.6,35.56 | v53.18,28.57 52.55,29.21 48.42,29.21 U4.26 | v59.85,27.3 64.14,27.3 67.47,30.64 67.47,31.43 v69.06,33.02
  Bottom 0.19: v53.18,28.57 55.56,28.57 56.83,27.3 v59.85,27.3 | v71.6,35.56 v69.06,33.02
SIMCLK  (via drill 0.39)
  Top 0.19: v38.89,40.32 40.48,40.32 41.91,38.89 41.91,37.31 U4.38 | v43.66,33.18 v41.91,34.92 | v73.18,24.61 v66.33,24.61
  Bottom 0.19: C35.1 68.26,24.13 68.58,24.13 68.74,24.29 69.85,24.29 70.01,24.13 C34.1 70.17,23.97 71.28,25.08 72.07,25.08 SIM2.CLK 72.23,25.24 72.87,24.61 v73.18,24.61 | v38.89,40.32 38.89,37.94 v41.91,34.92 | v43.66,33.18 45.56,33.18 54.13,24.61 v66.33,24.61
SIMDATA  (via drill 0.39)
  Top 0.19: v40.96,38.73 40.96,37.31 U4.39 | v67.63,27.94 v66.2,26.51
  Bottom 0.19: SIM2.IO 72.07,26.35 70.8,26.35 70.17,26.99 C32.1 70.01,26.99 68.26,26.99 C33.1 68.1,27.15 67.63,27.62 v67.63,27.94 | v40.96,38.73 40.96,38.42 54.29,25.08 64.77,25.08 v66.2,26.51
SIMRST  (via drill 0.39)
  Top 0.19: v40.16,39.37 39.85,39.05 39.85,37.31 U4.40 | v64.45,25.88 64.45,24.73 65.69,23.5 v69.06,23.5
  Bottom 0.19: 69.06,23.02 70.01,23.02 C24.1 70.17,23.02 72.07,23.02 SIM2.RST | 69.06,23.02 68.26,23.02 C30.1 | v40.16,39.37 40.48,39.37 40.64,39.53 41.27,39.53 51.91,28.89 51.91,28.1 54.45,25.56 64.14,25.56 v64.45,25.88 | 69.06,23.02 v69.06,23.5
SPK_N
  Top 0.254: U5.8 71.39,34.3 74.8,37.72 JP7.2
SPK_P
  Top 0.254: U5.7 71.57,33.8 75.32,37.56 75.32,39.38 JP7.1
UART_CTS  (via drill 0.39)
  Top 0.19: v34.29,21.91 35.4,21.91 36.35,22.86 36.35,23.34 U4.11 | v33.5,26.51 33.5,27.62 v37.15,31.27
  Bottom 0.19: v34.29,21.91 34.29,25.72 v33.5,26.51 | v37.15,31.27 39.69,31.27 U6.11
UART_RTS  (via drill 0.39)
  Top 0.19: v38.26,30.16 35.4,27.3 35.4,23.5 U4.10
  Bottom 0.19: v38.26,30.16 38.73,30.64 39.69,30.64 U6.12
UART_RXD  (via drill 0.39)
  Top 0.19: v41.12,29.37 38.58,26.83 38.58,23.5 U4.13
  Bottom 0.19: v41.12,29.37 40.48,30 39.85,30 U6.13
UART_TXD  (via drill 0.39)
  Top 0.19: v38.26,29.05 37.62,28.42 37.62,23.5 U4.12
  Bottom 0.19: v38.26,29.05 38.58,29.05 38.89,29.37 39.69,29.37 U6.14
V_INT  (via drill 0.39)
  Top 0.254: SV1.10 19.37,18.1 19.37,16.19 20,15.56 21.43,15.56 28.73,22.86 28.73,23.34 U4.4 | U5.6 61.12,33.02 61.59,33.02 v62.07,32.54 63.18,31.43 C16.1 63.34,31.27 64.29,30.32 64.29,28.73 64.14,28.57 v60.8,28.57 | v61.91,37.15 61.12,37.15 U5.13 | 64.29,35.88 64.93,35.88 66.67,37.62 68.58,37.62 R12.1 68.74,37.62 70.33,37.62 R13.1 | U5.11 61.82,35.75 64.29,35.75 64.29,35.88 | 64.29,35.88 v64.29,36.04 | v54.77,36.83 55.88,37.94 R11.1 | v32.38,16.51 32.7,16.51 38.1,21.91 v39.37,21.91
  Bottom 0.254: 61.91,36.04 61.91,32.7 v62.07,32.54 63.18,31.43 C16.1 | 61.91,36.04 v61.91,37.15 | v64.29,36.04 61.91,36.04 | 42.7,27.94 41.27,27.94 40.64,28.57 39.85,28.57 U6.15 | 42.7,27.94 43.18,27.94 C19.1 43.4,27.81 43.81,27.4 43.81,26.35 v39.37,21.91 | 54.96,36.83 56.2,36.83 56.83,36.2 58.42,36.2 C15.1 | 42.7,27.94 42.7,35.72 39.37,39.05 39.37,39.69 39.85,40.16 42.86,40.16 46.2,36.83 v54.77,36.83 54.96,36.83 | 54.96,36.83 54.96,29.69 55.65,29 55.74,29 56.16,28.57 v60.8,28.57 | v32.38,16.51 31.75,17.14 22.48,17.14 SV1.10
VBAT  (via drill 0.39)
  Top 0.19: v52.55,8.1 52.55,6.35 53.18,5.71 53.98,5.71 54.93,4.76 55.56,4.76 X2.2
  Bottom 0.19: 52.55,15.3 v52.55,8.1 | 30.79,3.94 30.99,3.94 30.99,5.71 X6.2 | C5.1 57.73,15.75 | 17.4,7.46 U3.3
  Bottom 0.406: D1.1 D11.1 78.52,17.24 61.44,17.24 60.67,17.24 59.69,16.26 C4.1 57.73,15.75 | C2.1 59.69,4.71 60.48,3.93 S1.3 | D7.1 63.8,6.48 62.72,5.4 C2.1 | X2.2 57.44,4.71 D5.C 58.56,5.4 C2.1 | C5.1 52.55,15.3 49.05,15.3 35.66,1.91 30.68,1.91 30.11,2.48 30.11,3.25 30.79,3.94 | C3.1 12,9.46 12.57,10.03 15.88,10.03 17.4,8.51 17.4,7.46 | X6.2 29.31,7.4 U3.3
VBAT_ON  (via drill 0.39)
  Top 0.19: U4.51 27.62,37.31 26.67,37.31 U4.52 26.51,37.31 25.56,37.31 U4.53 25.4,37.15 24.13,37.15 23.02,36.04 v23.02,35.24 | v11.43,5.56 v21.11,5.56
  Bottom 0.19: C29.1 C28.1 C27.1 C26.1 C25.1 28.89,36.83 28.42,37.31 C31.1 28.26,37.31 24.61,33.66 | 24.61,33.66 21.59,30.64 11.11,30.64 9.68,29.21 9.68,28.42 8.73,27.46 8.57,27.46 1.59,20.48 1.59,8.1 5.56,4.13 7.3,4.13 8.26,5.08 D4.A 10.16,5.08 10.64,5.56 v11.43,5.56 | 24.61,33.66 v23.02,35.24 | v21.11,5.56 26.18,0.49 53.1,0.49 56.14,3.53 S1.4
VBUS  (via drill 0.39)
  Top 0.19: 20.19,12.95 20.45,13.21 SV1.14
  Top 0.305: IC1.7 31.15,12.47 30.67,12.95
  Top 0.406: CHG.A 7.21,9.18 v6.48,9.91 v6.48,12.95 20.19,12.95 30.67,12.95
  Bottom 0.406: X3.5 6.25,12.73 v6.48,12.95 9.91,16.38 12.59,16.38 R6.2 13.63,17.35 U2.1 | D4.C 6.48,5.15 v6.48,9.91 9.36,7.03 C6.1 12.01,6.52 12.68,5.84 16.51,5.84 17.33,5.02 U3.4
VLED
  Bottom 0.406: S1.1 66.37,3.53 66.48,3.63 68.51,3.63 R15.1
VSIM  (via drill 0.39)
  Top 0.254: v49.85,34.45 49.85,40.01 47.15,42.7 40.16,42.7 38.1,40.64 38.1,40.01 38.58,39.53 38.58,37.31 U4.41 | v65.25,20.32 v59.21,26.35
  Bottom 0.254: SIM2.VCC 72.07,19.68 70.33,19.68 C23.1 70.17,19.53 68.26,19.53 C20.1 68.1,19.53 66.2,19.53 C22.1 66.04,19.53 v65.25,20.32 | v49.85,34.45 49.85,31.59 52.39,29.05 52.39,28.26 54.29,26.35 v59.21,26.35

## Text on the board
tPlace: #13 | CHG | RST